# Altium schematic sheet fpga_power.SchDoc: FPGA
size 297 x 209 mm; CheckedBy: MC, TW, EB; CompanyName: CERN; DrawnBy: Greg Kasprowicz; Organization: CERN; Address1: European Organization for Nuclear Research; Address2: CH-1211 Geneve 23 - Switzerland; DocumentNumber: 9; Revision: -; SheetNumber: 9; SheetTotal: 17; EDA_Number: EDA-02189-V4-0; Projet: Simple PCIe Carrier Board; ModifiedBy: TW, MC; CreateDate: 10/07/2010; CheckedDate: 11/05/2011; Title2: Power supplies; DivGrp: BE-CO; Designer: GK, MC, TW, EB, PAS; DocumentName: fpga_power.SchDoc; ModifiedDate: -
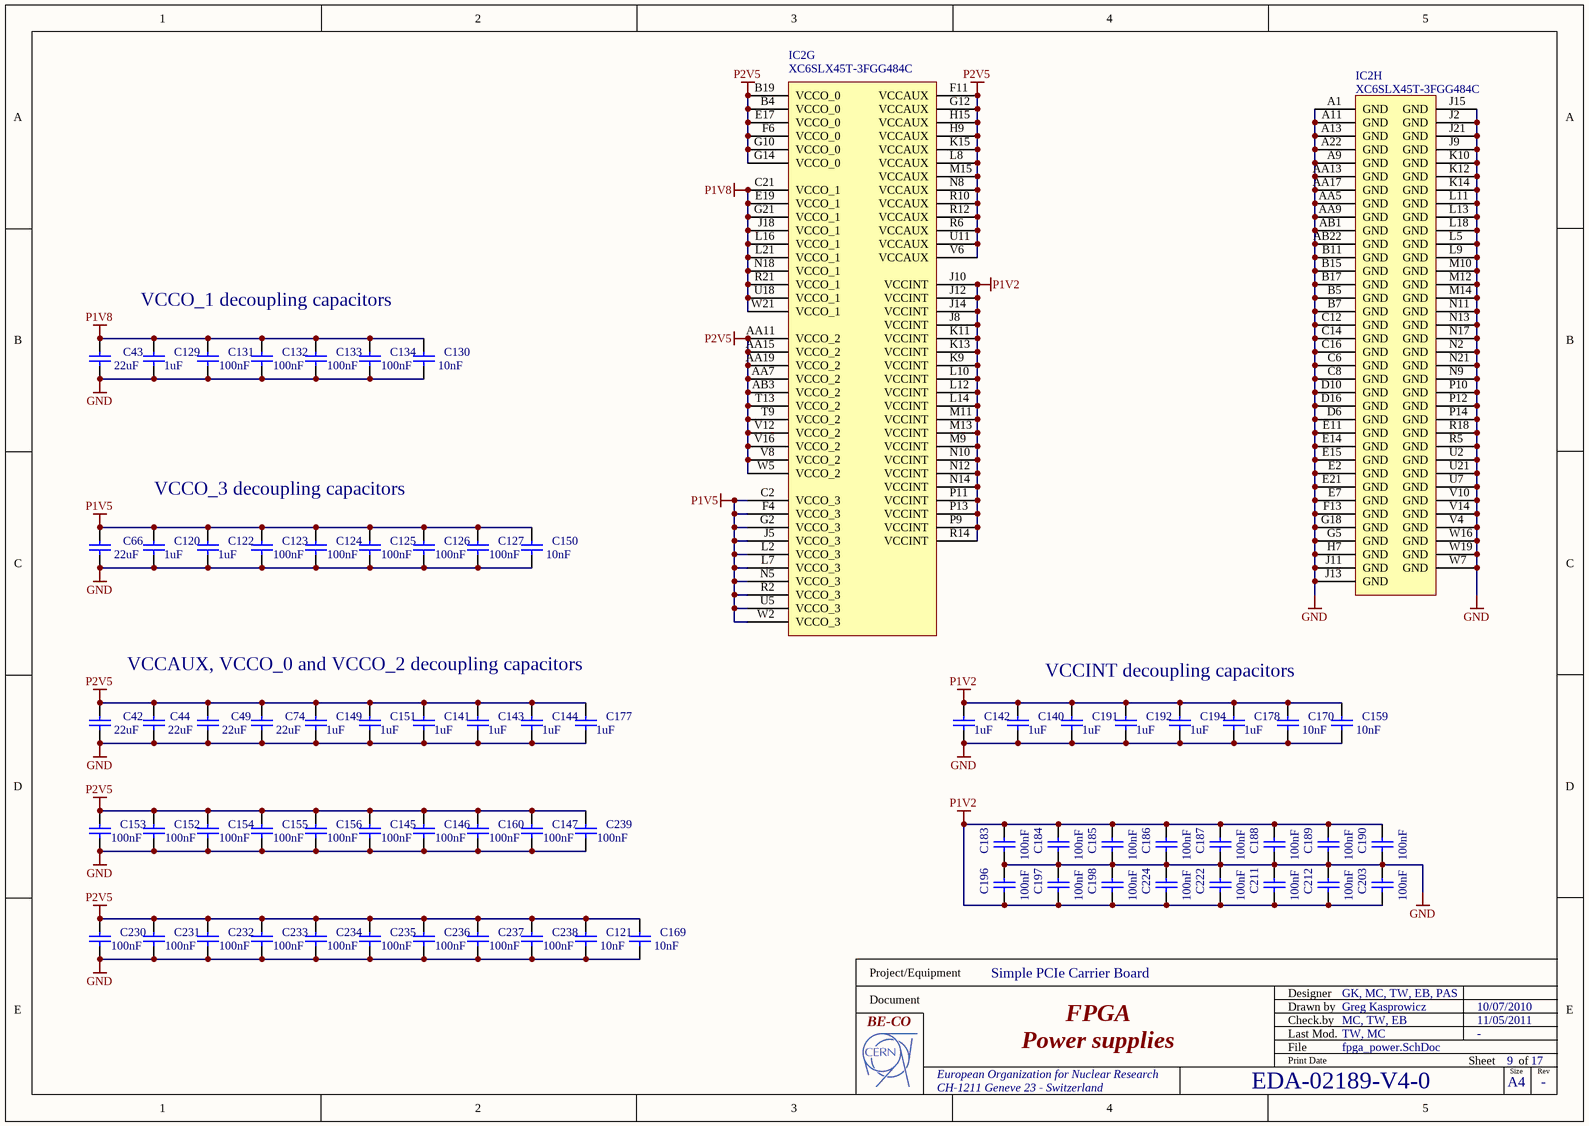
[diagram p0: fpga_power.SchDoc]

## Parts
C42  22uF  [CAPC3216X180N]
C43  22uF  [CAPC3216X180N]
C44  22uF  [CAPC3216X180N]
C49  22uF  [CAPC3216X180N]
C66  22uF  [CAPC3216X180N]
C74  22uF  [CAPC3216X180N]
C120  1uF  [CAPC1608X87N]
C121  10nF  [CAPC1608X87N]
C122  1uF  [CAPC1608X87N]
C123  100nF  [CAPC1005X55N]
C124  100nF  [CAPC1005X55N]
C125  100nF  [CAPC1005X55N]
C126  100nF  [CAPC1005X55N]
C127  100nF  [CAPC1005X55N]
C129  1uF  [CAPC1608X87N]
C130  10nF  [CAPC1608X87N]
C131  100nF  [CAPC1005X55N]
C132  100nF  [CAPC1005X55N]
C133  100nF  [CAPC1005X55N]
C134  100nF  [CAPC1005X55N]
C140  1uF  [CAPC1608X87N]
C141  1uF  [CAPC1608X87N]
C142  1uF  [CAPC1608X87N]
C143  1uF  [CAPC1608X87N]
C144  1uF  [CAPC1608X87N]
C145  100nF  [CAPC1005X55N]
C146  100nF  [CAPC1005X55N]
C147  100nF  [CAPC1005X55N]
C149  1uF  [CAPC1608X87N]
C150  10nF  [CAPC1608X87N]
C151  1uF  [CAPC1608X87N]
C152  100nF  [CAPC1005X55N]
C153  100nF  [CAPC1005X55N]
C154  100nF  [CAPC1005X55N]
C155  100nF  [CAPC1005X55N]
C156  100nF  [CAPC1005X55N]
C159  10nF  [CAPC1608X87N]
C160  100nF  [CAPC1005X55N]
C169  10nF  [CAPC1608X87N]
C170  10nF  [CAPC1608X87N]
C177  1uF  [CAPC1608X87N]
C178  1uF  [CAPC1608X87N]
C183  100nF  [CAPC1005X55N]
C184  100nF  [CAPC1005X55N]
C185  100nF  [CAPC1005X55N]
C186  100nF  [CAPC1005X55N]
C187  100nF  [CAPC1005X55N]
C188  100nF  [CAPC1005X55N]
C189  100nF  [CAPC1005X55N]
C190  100nF  [CAPC1005X55N]
C191  1uF  [CAPC1608X87N]
C192  1uF  [CAPC1608X87N]
C194  1uF  [CAPC1608X87N]
C196  100nF  [CAPC1005X55N]
C197  100nF  [CAPC1005X55N]
C198  100nF  [CAPC1005X55N]
C203  100nF  [CAPC1005X55N]
C211  100nF  [CAPC1005X55N]
C212  100nF  [CAPC1005X55N]
C222  100nF  [CAPC1005X55N]
C224  100nF  [CAPC1005X55N]
C230  100nF  [CAPC1005X55N]
C231  100nF  [CAPC1005X55N]
C232  100nF  [CAPC1005X55N]
C233  100nF  [CAPC1005X55N]
C234  100nF  [CAPC1005X55N]
C235  100nF  [CAPC1005X55N]
C236  100nF  [CAPC1005X55N]
C237  100nF  [CAPC1005X55N]
C238  100nF  [CAPC1005X55N]
C239  100nF  [CAPC1005X55N]
IC2  XC6SLX45T-3FGG484C  [BGA484C100P22X22_2300X2300X260]  (parts G,H of 9)

## Nets
GND: C42.1 C43.1 C44.1 C49.1 C66.1 C74.1 C120.1 C121.1 C122.1 C123.1 C124.1 C125.1 C126.1 C127.1 C129.1 C130.1 C131.1 C132.1 C133.1 C134.1 C140.2 C141.1 C142.2 C143.1 C144.1 C145.1 C146.1 C147.1 C149.1 C150.1 C151.1 C152.1 C153.1 C154.1 C155.1 C156.1 C159.1 C160.1 C169.1 C170.1 C177.1 C178.1 C183.1 C184.1 C185.1 C186.1 C187.1 C188.1 C189.1 C190.1 C191.1 C192.1 C194.1 C196.2 C197.2 C198.2 C203.2 C211.2 C212.2 C222.2 C224.2 C230.1 C231.1 C232.1 C233.1 C234.1 C235.1 C236.1 C237.1 C238.1 C239.1 IC2.A1(GND) IC2.A9(GND) IC2.A11(GND) IC2.A13(GND) IC2.A22(GND) IC2.AA5(GND) IC2.AA9(GND) IC2.AA13(GND) IC2.AA17(GND) IC2.AB1(GND) IC2.AB22(GND) IC2.B5(GND) IC2.B7(GND) IC2.B11(GND) IC2.B15(GND) IC2.B17(GND) IC2.C6(GND) IC2.C8(GND) IC2.C12(GND) IC2.C14(GND) IC2.C16(GND) IC2.D6(GND) IC2.D10(GND) IC2.D16(GND) IC2.E2(GND) IC2.E7(GND) IC2.E11(GND) IC2.E14(GND) IC2.E15(GND) IC2.E21(GND) IC2.F13(GND) IC2.G5(GND) IC2.G18(GND) IC2.H7(GND) IC2.J2(GND) IC2.J9(GND) IC2.J11(GND) IC2.J13(GND) IC2.J15(GND) IC2.J21(GND) IC2.K10(GND) IC2.K12(GND) IC2.K14(GND) IC2.L5(GND) IC2.L9(GND) IC2.L11(GND) IC2.L13(GND) IC2.L18(GND) IC2.M10(GND) IC2.M12(GND) IC2.M14(GND) IC2.N2(GND) IC2.N9(GND) IC2.N11(GND) IC2.N13(GND) IC2.N17(GND) IC2.N21(GND) IC2.P10(GND) IC2.P12(GND) IC2.P14(GND) IC2.R5(GND) IC2.R18(GND) IC2.U2(GND) IC2.U7(GND) IC2.U21(GND) IC2.V4(GND) IC2.V10(GND) IC2.V14(GND) IC2.W7(GND) IC2.W16(GND) IC2.W19(GND)
P1V2: C140.1 C142.1 C159.2 C170.2 C178.2 C183.2 C184.2 C185.2 C186.2 C187.2 C188.2 C189.2 C190.2 C191.2 C192.2 C194.2 C196.1 C197.1 C198.1 C203.1 C211.1 C212.1 C222.1 C224.1 IC2.J8(VCCINT) IC2.J10(VCCINT) IC2.J12(VCCINT) IC2.J14(VCCINT) IC2.K9(VCCINT) IC2.K11(VCCINT) IC2.K13(VCCINT) IC2.L10(VCCINT) IC2.L12(VCCINT) IC2.L14(VCCINT) IC2.M9(VCCINT) IC2.M11(VCCINT) IC2.M13(VCCINT) IC2.N10(VCCINT) IC2.N12(VCCINT) IC2.N14(VCCINT) IC2.P9(VCCINT) IC2.P11(VCCINT) IC2.P13(VCCINT) IC2.R14(VCCINT)
P1V5: C66.2 C120.2 C122.2 C123.2 C124.2 C125.2 C126.2 C127.2 C150.2 IC2.C2(VCCO_3) IC2.F4(VCCO_3) IC2.G2(VCCO_3) IC2.J5(VCCO_3) IC2.L2(VCCO_3) IC2.L7(VCCO_3) IC2.N5(VCCO_3) IC2.R2(VCCO_3) IC2.U5(VCCO_3) IC2.W2(VCCO_3)
P1V8: C43.2 C129.2 C130.2 C131.2 C132.2 C133.2 C134.2 IC2.C21(VCCO_1) IC2.E19(VCCO_1) IC2.G21(VCCO_1) IC2.J18(VCCO_1) IC2.L16(VCCO_1) IC2.L21(VCCO_1) IC2.N18(VCCO_1) IC2.R21(VCCO_1) IC2.U18(VCCO_1) IC2.W21(VCCO_1)
P2V5: C42.2 C44.2 C49.2 C74.2 C121.2 C141.2 C143.2 C144.2 C145.2 C146.2 C147.2 C149.2 C151.2 C152.2 C153.2 C154.2 C155.2 C156.2 C160.2 C169.2 C177.2 C230.2 C231.2 C232.2 C233.2 C234.2 C235.2 C236.2 C237.2 C238.2 C239.2 IC2.AA7(VCCO_2) IC2.AA11(VCCO_2) IC2.AA15(VCCO_2) IC2.AA19(VCCO_2) IC2.AB3(VCCO_2) IC2.B4(VCCO_0) IC2.B19(VCCO_0) IC2.E17(VCCO_0) IC2.F6(VCCO_0) IC2.F11(VCCAUX) IC2.G10(VCCO_0) IC2.G12(VCCAUX) IC2.G14(VCCO_0) IC2.H9(VCCAUX) IC2.H15(VCCAUX) IC2.K15(VCCAUX) IC2.L8(VCCAUX) IC2.M15(VCCAUX) IC2.N8(VCCAUX) IC2.R6(VCCAUX) IC2.R10(VCCAUX) IC2.R12(VCCAUX) IC2.T9(VCCO_2) IC2.T13(VCCO_2) IC2.U11(VCCAUX) IC2.V6(VCCAUX) IC2.V8(VCCO_2) IC2.V12(VCCO_2) IC2.V16(VCCO_2) IC2.W5(VCCO_2)

## Notes on the sheet
- VCCO_1 decoupling capacitors
- VCCO_3 decoupling capacitors
- VCCAUX, VCCO_0 and VCCO_2 decoupling capacitors
- VCCINT decoupling capacitors
- Project/Equipment
- Document
- Designer
- Drawn by
- Check.by
- File
- Last Mod.
- Print Date
- Sheet
- Size
- A4
- of
- Rev

## Library data of the parts
C42-C44 C49 C66 C74 = CC1206_22UF_10V_10%_X7R: Non-polarised capacitor; Part Description: SMD Multilayer Chip Ceramic Capacitor; Manufacturer: GENERIC; Manufacturer1 Part Number: GRM31CR71A226KE15L; Voltage: 10V; TC: X7R; Tolerance: ±10%; Table: Capacitors SMD; Part Number: CC1206_22UF_10V_10%_X7R; Component Kind: Standard; Component Type: Standard; Pin Count: 2; Value: 22uF; Status: Preferred; Manufacturer Part Number: CC1206_22UF_10V_10%_X7R; Case: 1206; Mounted: Yes; Socket: No; SMD: Yes; Manufacturer1 Example: MURATA; Manufacturer1 ComponentHeight: 1.8mm; HelpURL: \\cern.ch\dfs\Applications\Altium\Datasheets\CC1206_X7R_MURATA_GRM-HI-CAP.pdf; Author: CERN DEM JLC; CreateDate: 2010-06-08; LatestRevisionDate: 2010-06-08
C120 C122 C129 C140-C144 C149 C151 C177 C178 C191 C192 C194 = CC0603_1UF_16V_10%_X7R: Non-polarised capacitor; Part Description: SMD Multilayer Chip Ceramic Capacitor; Manufacturer: GENERIC; Manufacturer1 Part Number: 223824613663; Voltage: 16V; TC: X7R; Tolerance: ±10%; Table: Capacitors SMD; Part Number: CC0603_1UF_16V_10%_X7R; Component Kind: Standard; Component Type: Standard; Pin Count: 2; Value: 1uF; Status: Preferred; Manufacturer Part Number: CC0603_1uF_16V_10%_X7R; Case: 0603; Mounted: Yes; Socket: No; SMD: Yes; Manufacturer1 Example: PHYCOMP; Manufacturer1 ComponentHeight: 0.87mm; HelpURL: \\cern.ch\dfs\Applications\Altium\Datasheets\CC0805_X5R_PHYCOMP_HC.pdf; Author: CERN DEM JLC
  C120 C122 C129 C141 C143 C144 C149 C151 C177 C178 C191 C192 C194: CreateDate: 03/12/2007; LatestRevisionDate: 03/12/2007
  C140 C142: CreateDate: 12/3/2007; LatestRevisionDate: 12/3/2007
C121 C130 C150 C159 C169 C170 = CC0603_10NF_50V_10%_X7R: Non-polarised capacitor; Part Description: SMD Multilayer Chip Ceramic Capacitor; Manufacturer: GENERIC; Manufacturer1 Part Number: 223858615636; Voltage: 50V; TC: X7R; Tolerance: ±10%; Table: Capacitors SMD; Part Number: CC0603_10NF_50V_10%_X7R; Component Kind: Standard; Component Type: Standard; Pin Count: 2; Value: 10nF; Status: Preferred; Manufacturer Part Number: CC0603_10NF_50V_10%_X7R; Case: 0603; Mounted: Yes; Socket: No; SMD: Yes; Manufacturer1 Example: PHYCOMP; Manufacturer1 ComponentHeight: 0.87mm; HelpURL: \\cern.ch\dfs\Applications\Altium\Datasheets\CC0603_X7R_PHYCOMP.pdf; Author: CERN DEM JLC; CreateDate: 03/12/2007; LatestRevisionDate: 03/12/2007
C123-C127 C131-C134 C145-C147 C152-C156 C160 C183-C190 C196-C198 C203 C211 C212 C222 C224 C230-C239 = CC0402_100NF_16V_10%_X7R: Non-polarised capacitor; Part Description: SMD Multilayer Chip Ceramic Capacitor; Manufacturer: GENERIC; Manufacturer1 Part Number: 223878715649; Voltage: 16V; TC: X7R; Tolerance: ±10%; Table: Capacitors SMD; Part Number: CC0402_100NF_16V_10%_X7R; Component Kind: Standard; Component Type: Standard; Pin Count: 2; Value: 100nF; Status: Not Recommended; Manufacturer Part Number: CC0402_100NF_16V_10%_X7R; Case: 0402; Mounted: Yes; Socket: No; SMD: Yes; Manufacturer1 Example: PHYCOMP; Manufacturer1 ComponentHeight: 0.55mm; HelpURL: \\cern.ch\dfs\Applications\Altium\Datasheets\CC0402_X7R_PHYCOMP.pdf; Author: CERN DEM JLC; CreateDate: 03/12/2007; LatestRevisionDate: 03/12/2007
IC2 = XC6SLX45T-3FGG484C: Spartan-6 LXT 1.2V FPGA, 296 User I/Os, 484-Ball Fine-Pitch BGA (1.0mm Pitch), Speed Grade 3, Commercial Grade, Pb-Free; Manufacturer: XILINX; Table: Logic; Part Number: XC6SLX45T-3FGG484C; Component Kind: Standard; Component Type: Standard; Device: XC6SLX45T-3FGG484C; PackageDescription: BGA,1.00mm pitch,square;484 pin,22 columns X 22 rows,23.00mm X 23.00mm X 2.60mm H; Part Description: Spartan-6 LXT 1.2V FPGA, 296 User I/Os, 484-Ball Fine-Pitch BGA (1.0mm Pitch), Speed Grade 3, Commercial Grade, Pb-Free; Manufacturer Part Number: XC6SLX45T-3FGG484C; Pin Count: 484; Case: BGA484; Mounted: Yes; Socket: No; SMD: Yes; ComponentHeight: 2.6mm; HelpURL: \\cern.ch\dfs\Applications\Altium\Datasheets\XC6SLX45T-3FGG484C.pdf; ComponentLink1URL: \\cern.ch\dfs\Applications\Altium\Datasheets\XC6SLX45T-3FGG484C_Package-Pinouts.pdf; ComponentLink1Description: Package/Pinouts; Author: CERN DEM JLC; CreateDate: 2010-07-08; LatestRevisionDate: 2010-07-08